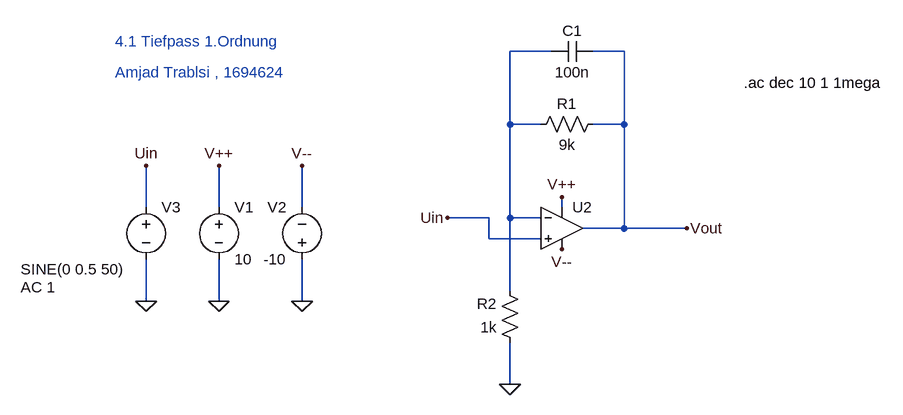
[diagram p0: schematic 4_1.asc]
4_1.asc, the LTspice schematic file:
Version 4
SHEET 1 2212 680
WIRE 336 -192 272 -192
WIRE 448 -192 400 -192
WIRE 272 -80 272 -192
WIRE 320 -80 272 -80
WIRE 448 -80 448 -192
WIRE 448 -80 400 -80
WIRE -288 48 -288 -16
WIRE -176 48 -176 -16
WIRE -48 48 -48 -16
WIRE 352 48 352 32
WIRE 240 64 176 64
WIRE 272 64 272 -80
WIRE 320 64 272 64
WIRE 448 80 448 -80
WIRE 448 80 384 80
WIRE 544 80 448 80
WIRE 240 96 240 64
WIRE 320 96 240 96
WIRE 272 176 272 64
WIRE -288 192 -288 128
WIRE -176 192 -176 128
WIRE -48 192 -48 128
WIRE 272 320 272 256
FLAG 272 320 0
FLAG -176 192 0
FLAG -176 -16 V++
FLAG 352 32 V++
FLAG -48 192 0
FLAG -48 -16 V--
FLAG 352 112 V--
FLAG 544 80 Vout
FLAG -288 192 0
FLAG -288 -16 Uin
FLAG 176 64 Uin
SYMBOL cap 400 -208 R90
WINDOW 0 0 32 VBottom 2
WINDOW 3 32 32 VTop 2
SYMATTR InstName C1
SYMATTR Value 100n
SYMBOL res 416 -96 R90
WINDOW 0 0 56 VBottom 2
WINDOW 3 32 56 VTop 2
SYMATTR InstName R1
SYMATTR Value 9k
SYMBOL res 288 272 R180
WINDOW 0 36 76 Left 2
WINDOW 3 36 40 Left 2
SYMATTR InstName R2
SYMATTR Value 1k
SYMBOL voltage -176 32 R0
WINDOW 123 0 0 Left 0
WINDOW 39 0 0 Left 0
SYMATTR InstName V1
SYMATTR Value 10
SYMBOL voltage -48 144 R180
WINDOW 0 24 96 Left 2
WINDOW 3 24 16 Left 2
WINDOW 123 0 0 Left 0
WINDOW 39 0 0 Left 0
SYMATTR InstName V2
SYMATTR Value -10
SYMBOL voltage -288 32 R0
WINDOW 3 -193 111 Left 2
WINDOW 123 -193 139 Left 2
WINDOW 39 0 0 Left 0
SYMATTR Value SINE(0 0.5 50)
SYMATTR Value2 AC 1
SYMATTR InstName V3
SYMBOL OpAmps/UniversalOpAmp 352 80 R0
SYMATTR InstName U2
TEXT -336 -208 Left 2 ;4.1 Tiefpass 1.Ordnung
TEXT 632 -144 Left 2 !.ac dec 10 1 1mega
TEXT -336 -160 Left 2 ;Amjad Trablsi , 1694624

The netlist it stands for:
* 4_1.asc
C1 Vout N001 100n
R1 Vout N001 9k
R2 0 N001 1k
V1 V++ 0 10
V2 0 V-- -10
V3 Uin 0 SINE(0 0.5 50) AC 1
XU2 Uin N001 V++ V-- Vout level1 Avol=1Meg GBW=10Meg Vos=0 En=0 Enk=0 In=0 Ink=0 Rin=500Meg  ; pins In+ In- V+ V- OUT
* 4.1 Tiefpass 1.Ordnung
.ac dec 10 1 1mega
* Amjad Trablsi , 1694624
.lib UniversalOpAmp1.lib
.backanno
.end